# EAGLE design untitled2b (EAGLE 7.6.0)
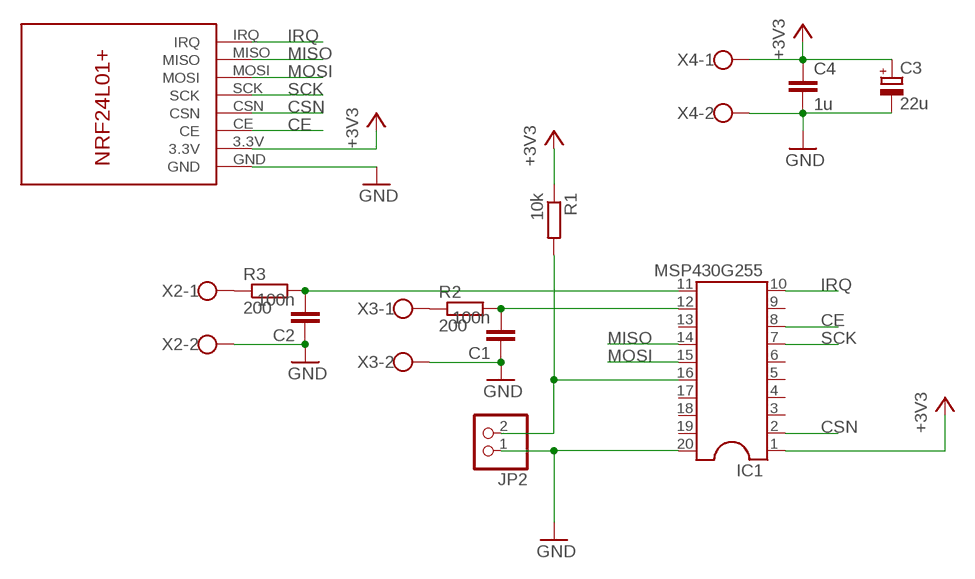
[diagram p0: schematic, sheet 1]

## Parts
C1  100n  C-EU050-025X075  [C050-025X075]
C2  100n  C-EU050-025X075  [C050-025X075]
C3  22u  CPOL-EUE5-8.5  [E5-8,5]
C4  1u  C-EU050-045X075  [C050-045X075]
IC1  MSP430G255  DIL20S  [SOCKET-20]
JP2  PINHD-1X2  [1X02]
R1  10k  R-EU_0207/10  [0207/10]
R2  200  R-EU_0207/10  [0207/10]
R3  200  R-EU_0207/10  [0207/10]
U$1  NRF24L01  [NRF24L01]
X2  W237-102  [W237-102]
X3  W237-102  [W237-102]
X4  W237-102  [W237-102]

## Nets
+3V3: C3.+ C4.1 IC1.1 R1.1 U$1.3.3V X4.1
CE: IC1.8 U$1.CE
CSN: IC1.2 U$1.CSN
GND: C1.1 C2.1 C3.- C4.2 IC1.20 JP2.1 U$1.GND X2.2 X3.2 X4.2
IRQ: IC1.10 U$1.IRQ
MISO: IC1.14 U$1.MISO
MOSI: IC1.15 U$1.MOSI
N$1: C1.2 IC1.12 R2.2
N$2: R3.1 X2.1
N$3: R2.1 X3.1
N$6: C2.2 IC1.11 R3.2
N$17: IC1.16 JP2.2 R1.2
SCK: IC1.7 U$1.SCK
Unconnected: IC1.3 IC1.4 IC1.5 IC1.6 IC1.9 IC1.13 IC1.17 IC1.18 IC1.19

## Library data of the parts
C1 C2 C4 = rcl:C-EU: CAPACITOR, European symbol
C3 = rcl:CPOL-EU: POLARIZED CAPACITOR, European symbol
IC1 = ic-package:DIL20: Dual In Line / Socket
JP2 = pinhead:PINHD-1X2: PIN HEADER
R1-R3 = rcl:R-EU_: RESISTOR, European symbol
U$1 = ebay-parts:NRF24L01: NRF24L01+ module from eBay NOTE: Untested layout
X2-X4 = con-wago-500:W237-102: WAGO SCREW CLAMP; MPN: 237-102; OC_FARNELL: unknown; OC_NEWARK: 70K9898

## Board
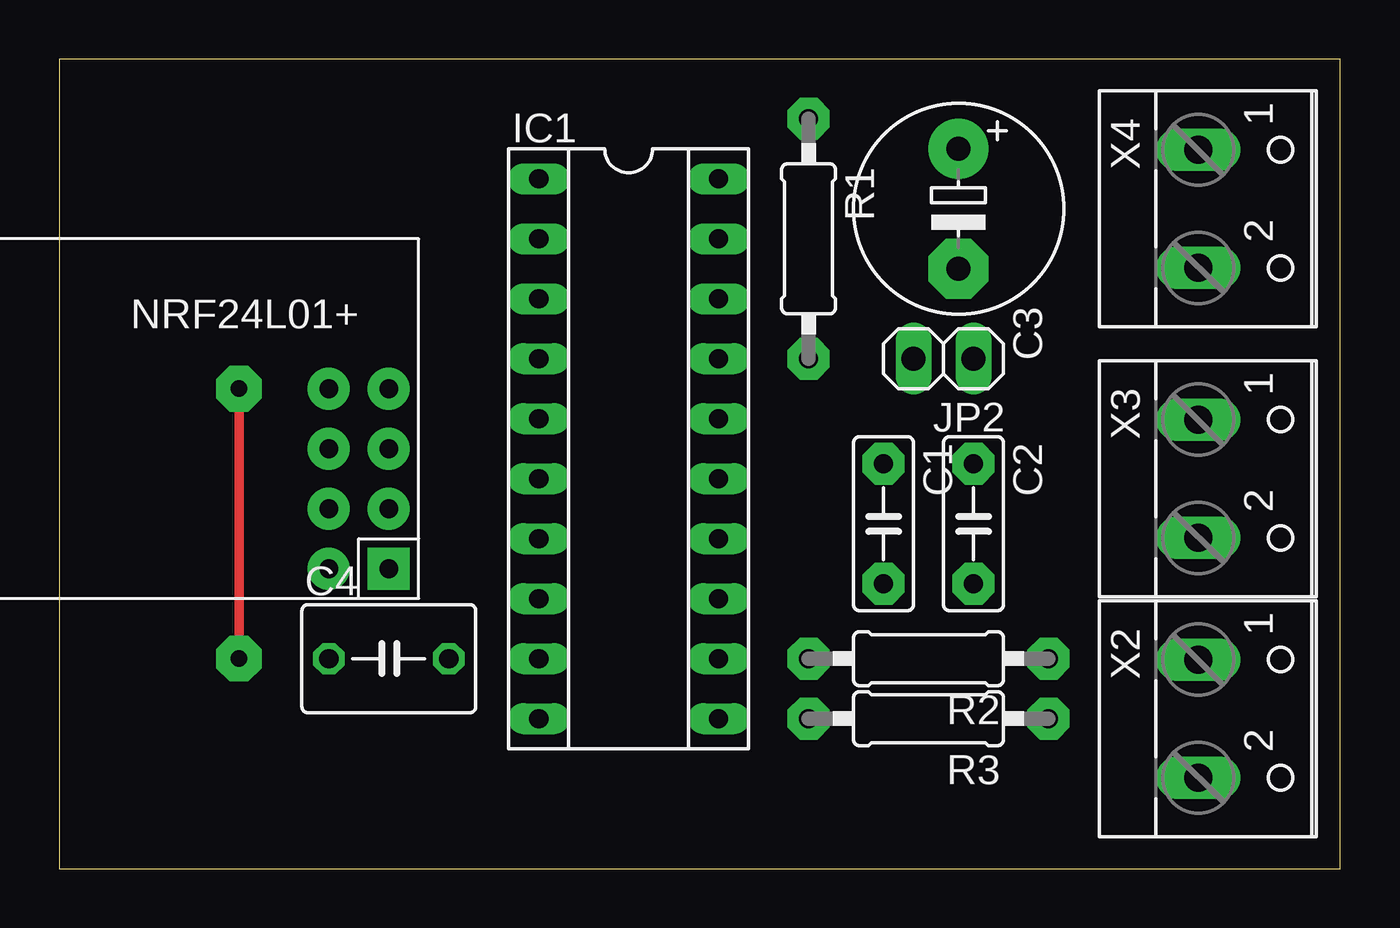
[diagram p1: board, top side]
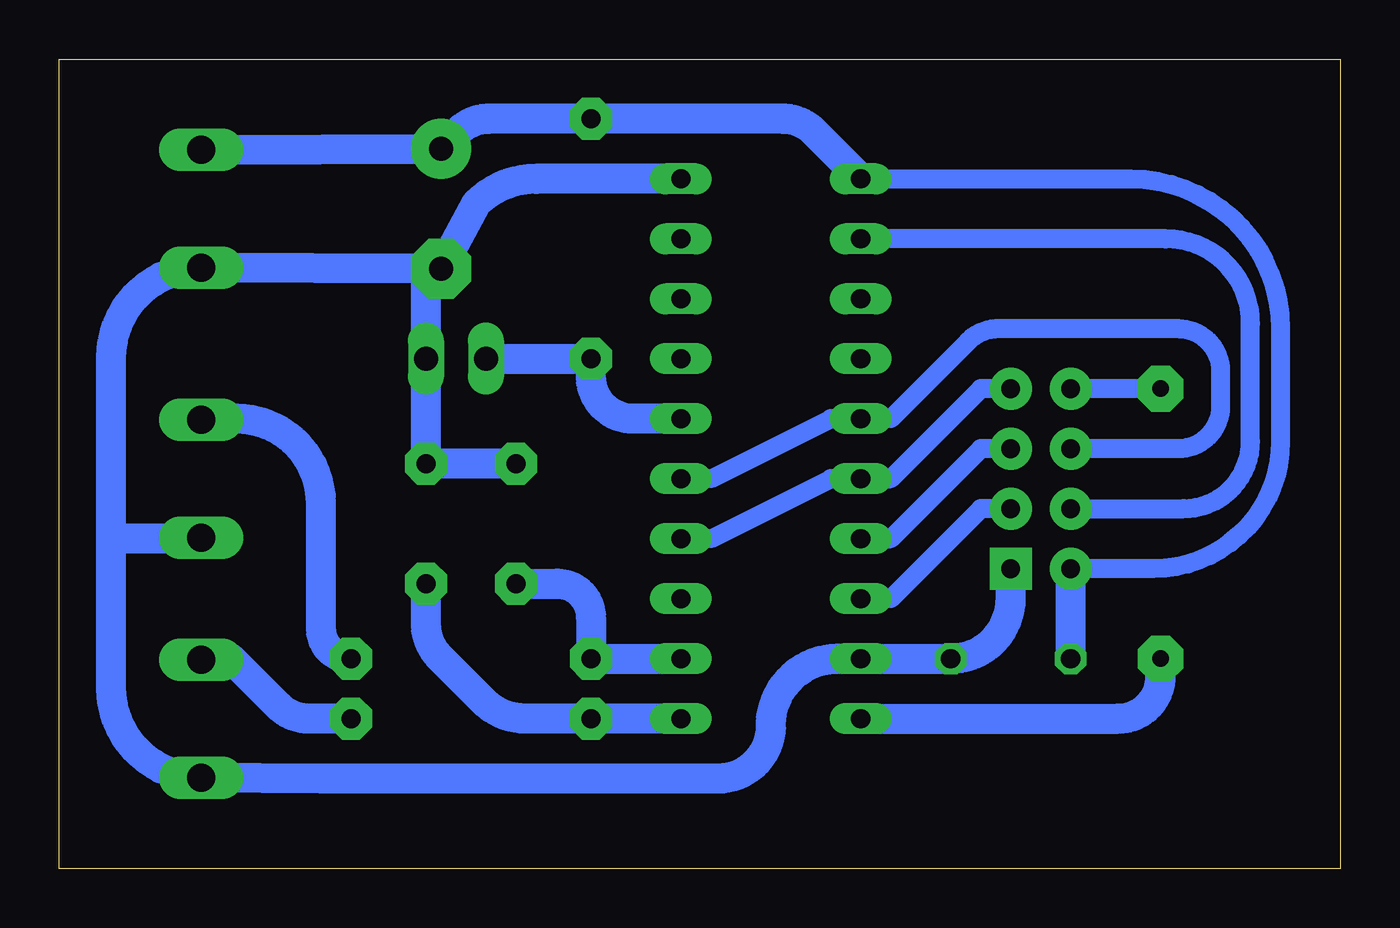
[diagram p2: board, bottom side, seen from below]

Size 54.28 x 34.28 mm. Coordinates in mm from the lower left corner, seen from the top.
Outline: 0,0 54.28,0 54.28,34.28 0,34.28 0,0
Copper layers (1*16): Top 0.035mm / dielectric 1.5mm / Bottom 0.035mm
Design rules "default": minimum track width 10mil, minimum drill 24mil, track to track 8mil, track to pad 8mil, pad to pad 8mil, via to via 8mil, smd to smd 8mil, copper to edge 40mil, drill to drill 8mil, minimum pad ring 10mil, minimum via ring 8mil, stop-mask expansion 4mil, vias tented up to drill 0mil, thermal gap 10mil

### Footprints (pad centres in the part's own frame; a part is rotated, then mirrored left to right if it is on the bottom)
C050-025X075 = drill 0.813 pad 1.778 octagon: 1 -2.54,0; 2 2.54,0
E5-8,5 = drill 1.016 pad 2.54: + -2.54,0 | drill 1.016 pad 2.54 octagon: - 2.54,0
C050-045X075 = drill 0.813 octagon: 1 -2.54,0; 2 2.54,0
SOCKET-20 = drill 0.813 long: 1 -11.43,-3.81; 2 -8.89,-3.81; 3 -6.35,-3.81; 4 -3.81,-3.81; 5 -1.27,-3.81; 6 1.27,-3.81; 7 3.81,-3.81; 8 6.35,-3.81; 9 8.89,-3.81; 10 11.43,-3.81; 11 11.43,3.81; 12 8.89,3.81; 13 6.35,3.81; 14 3.81,3.81; 15 1.27,3.81; 16 -1.27,3.81; 17 -3.81,3.81; 18 -6.35,3.81; 19 -8.89,3.81; 20 -11.43,3.81
1X02 = drill 1.016 long: 1 -1.27,0; 2 1.27,0
0207/10 = drill 0.813 pad 1.778 octagon: 1 -5.08,0; 2 5.08,0
NRF24L01 = drill 0.8 pad 1.778: 3.3V 0,2.54; CE 2.54,0; CSN 2.54,2.54; IRQ 7.62,2.54; MISO 7.62,0; MOSI 5.08,2.54; SCK 5.08,0 | drill 0.8 pad 1.778 square: GND 0,0
W237-102 = drill 1.194 long: 1 -2.5,-1.27; 2 2.5,-1.27

### Placement (x,y rotation side)
C1  34.92,14.61 270 top
C2  38.73,14.61 270 top
C3  38.1,27.94 270 top
C4  13.97,8.89 0 top
IC1  24.13,17.78 270 top
JP2  37.47,21.59 180 top
R1  31.75,26.67 270 top
R2  36.83,8.89 180 top
R3  36.83,6.35 180 top
U$1  13.97,12.7 90 top
X2  49.53,6.35 270 top
X3  49.53,16.51 270 top
X4  49.53,27.94 270 top

### Tracks (layer width: path | path; a pad name or v marks a point on that pad's centre or on a via)
+3V3
  Bottom 0.813: IC1.1 8.89,29.21 arc90 2.54,22.86 2.54,18.09 arc90 7.93,12.7 U$1.3.3V
  Bottom 1.27: C4.1 U$1.3.3V | X4.1 C3.+ 37.36,31.22 arc45 36.09,31.75 R1.1 23.6,31.75 arc45 22.33,31.22 IC1.1
CE
  Bottom 0.813: U$1.CE 15.24,15.24 19.05,11.43 IC1.8
CSN
  Bottom 0.813: U$1.CSN 6.65,15.24 arc-90 3.81,18.08 3.81,23.08 arc-90 7.4,26.67 IC1.2
GND
  Bottom 0.406: X3.2 arc90 48.3,13.97
  Bottom 0.813: C3.- 38.73,25.4
  Bottom 1.27: 52.07,13.97 52.07,7.66 arc-90 X2.2 43.18,3.81 26.37,3.81 arc-90 24.13,6.05 arc90 21.29,8.89 C4.2 arc-90 13.97,11.43 U$1.GND | 52.07,13.97 52.07,21.63 arc90 X4.2 38.73,25.4 JP2.1 C2.1 C1.1 | 48.3,13.97 52.07,13.97 | IC1.20 34.07,29.21 arc-45 36.61,28.16 C3.-
IRQ  (via drill 0.6, 0.7 pad 1.93)
  Top 0.406: v7.62,8.89 v7.62,20.32
  Bottom 0.813: v7.62,20.32 U$1.IRQ
  Bottom 1.27: IC1.10 9.42,6.35 arc-90 7.62,8.15 v7.62,8.89
MISO
  Bottom 0.406: IC1.14 26.67,13.97
  Bottom 0.813: U$1.MISO 15.24,20.32 19.05,16.51 21.59,16.51 26.67,13.97
MOSI
  Bottom 0.406: IC1.15 26.67,16.51 | 21.59,19.05 19.05,19.05
  Bottom 0.813: U$1.MOSI 6.88,17.78 arc-90 5.08,19.58 5.08,21.06 arc-90 6.88,22.86 14.5,22.86 arc-45 15.77,22.33 19.05,19.05 | 26.67,16.51 21.59,19.05
N$1
  Bottom 1.27: IC1.12 R2.2 31.75,10.64 arc-90 33.17,12.06 C1.2
N$2
  Bottom 0.406: 46.99,8.89 47.03,8.85
  Bottom 1.27: R3.1 43.71,6.35 arc45 44.98,6.88 46.99,8.89 | 47.03,8.85 X2.1
N$3
  Bottom 1.27: R2.1 arc90 43.18,10.16 43.18,15.46 arc-90 46.77,19.05 48.26,19.05 X3.1
N$6
  Bottom 1.27: IC1.11 R3.2 34.51,6.35 arc45 36.3,7.09 38.15,8.94 arc45 38.73,10.36 C2.2
N$17
  Bottom 0.406: 31.75,20.85 R1.2
  Bottom 1.27: IC1.16 29.95,19.05 arc90 31.75,20.85 | JP2.2 R1.2
SCK
  Bottom 0.813: U$1.SCK 15.24,17.78 19.05,13.97 IC1.7